# Altium schematic sheet X1.SchDoc
size A4; SheetNumber: 1; SheetTotal: 1; SPICEModelCacheZMLIXMBS: <root> / <DocumentId>ZMLIXMBS</DocumentId> / <CacheFrame Number="0"> / <Model Name="cap" Kind="MDL"> / <Text>*Default semiconductor capacitor / .MODEL CAP C()</Text> / </Model> / <Model Name="xtal" Kind="CKT"> / <Text>*Generic type:crystal pkg:HC33/51 / .SUBCKT XTAL 1 2 PARAMS: FREQ=1Meg RS=750 C=13pf Q=1000 / LX 1 3 {((Q*RS)/(6.2831852*FREQ))} IC=0.5M / CX 3 4 {(1/(Q*6.2831852*FREQ*RS))} / C0 1 2 {C} / RS 4 2 {RS} / .ENDS XTAL</Text> / </Model> / <Model Name="led2" Kind="MDL"> / <Text>*Typ RED,GREEN,YELLOW,AMBER GaAs LED: Vf=2.1V Vr=4V If=40mA trr=3uS / *LED Pinout: 1=A, 2=K / .MODEL LED2 D (IS=93.1P RS=42M N=4.61 BV=4 IBV=10U / + CJO=2.97P VJ=.75 M=.333 TT=4.32U)</Text> / </Model> / <Model Name="1n4148" Kind="MDL"> / <Text>.model 1N4148  D(Is=0.1p Rs=16 CJO=2p Tt=12n Bv=100 Ibv=0.1p)</Text> / </Model> / </CacheFrame> / </root>
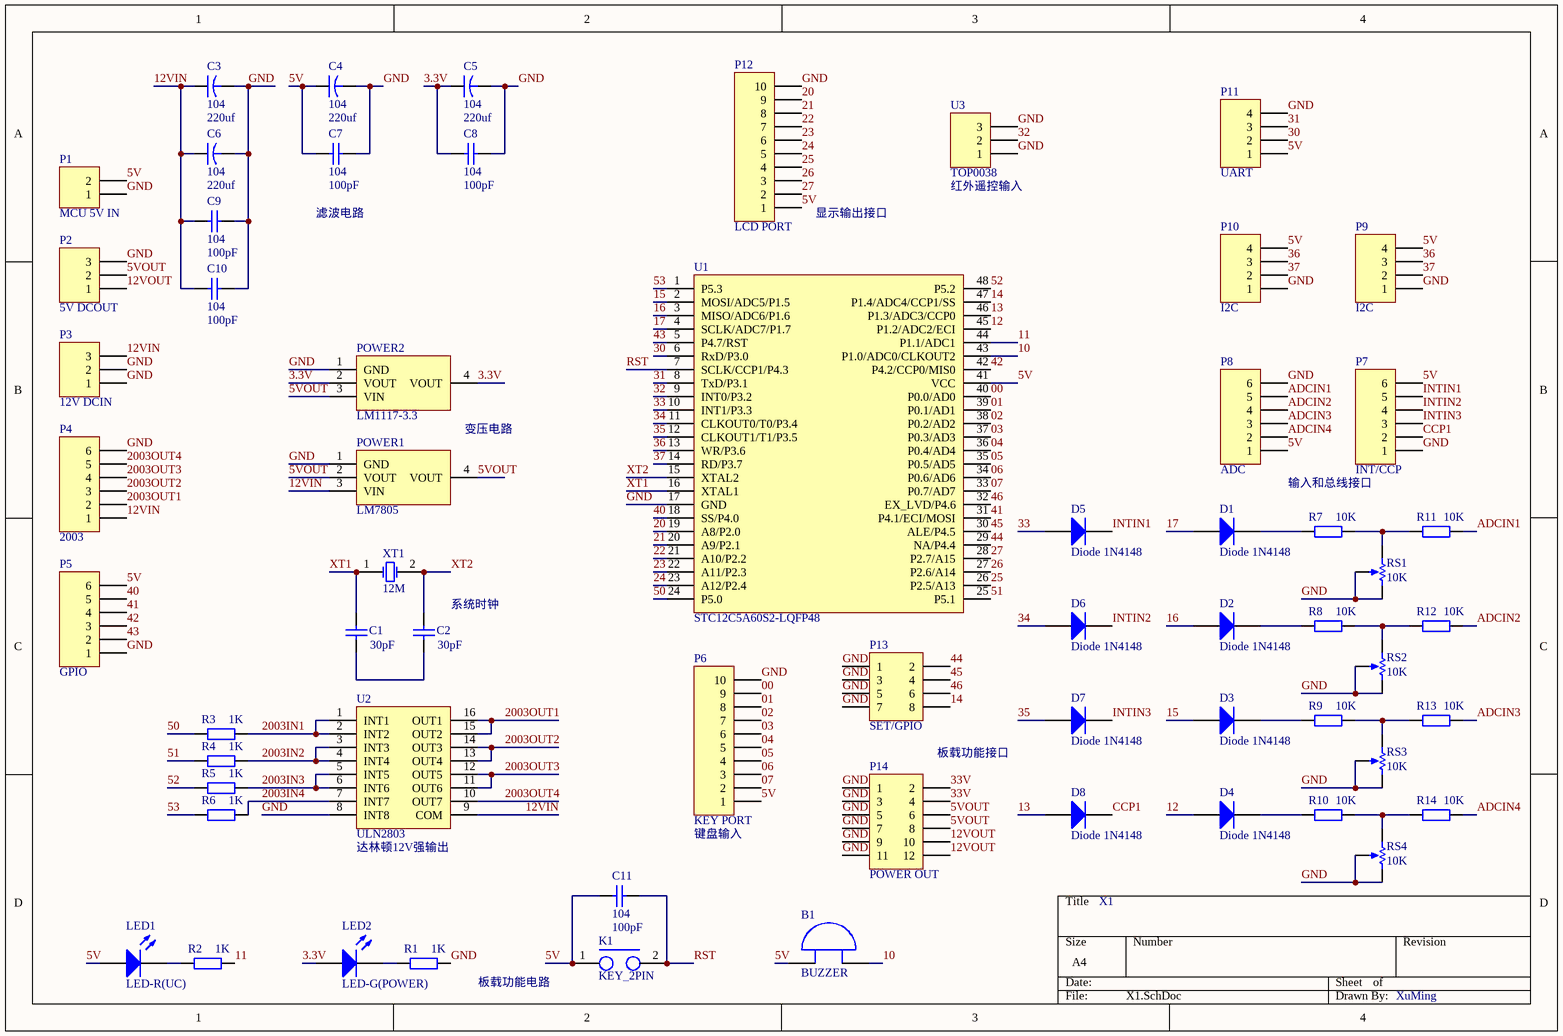
[diagram p0: X1.SchDoc]

## Parts
B1  BUZZER  [BEEP1]
C1  value 30pF  [0805]  (hidden comment: Cap)
C2  value 30pF  [0805]  (hidden comment: Cap)
C3  104  value 220uf  [C107V]
C4  104  value 220uf  [C107V]
C5  104  value 220uf  [C107V]
C6  104  value 220uf  [C107V]
C7  104  value 100pF  [0805]
C8  104  value 100pF  [0805]
C9  104  value 100pF  [0805]
C10  104  value 100pF  [0805]
C11  104  value 100pF  [0805]
D1  Diode 1N4148  [0805]
D2  Diode 1N4148  [0805]
D3  Diode 1N4148  [0805]
D4  Diode 1N4148  [0805]
D5  Diode 1N4148  [0805]
D6  Diode 1N4148  [0805]
D7  Diode 1N4148  [0805]
D8  Diode 1N4148  [0805]
K1  KEY_2PIN  [KEY-4Pin]
LED1  LED-R(UC)  [0805]
LED2  LED-G(POWER)  [0805]
P1  MCU 5V IN  [HDR1X2]
P2  5V DCOUT  [HDR1X3]
P3  12V DCIN  [HDR1X3]
P4  2003  [HDR1X6]
P5  GPIO  [HDR1X6]
P6  KEY PORT  [HDR1X10]
P7  INT/CCP  [HDR1X6]
P8  ADC  [HDR1X6]
P9  I2C  [HDR1X4]
P10  I2C  [HDR1X4]
P11  UART  [HDR1X4]
P12  LCD PORT  [HDR1X10]
P13  SET/GPIO  [HDR2X4]
P14  POWER OUT  [HDR2X6]
POWER1  LM7805  [SOT223_N]
POWER2  LM1117-3.3  [SOT223_N]
R1  value 1K  [0805]  (hidden comment: Res2)
R2  value 1K  [0805]  (hidden comment: Res2)
R3  value 1K  [0805]  (hidden comment: Res2)
R4  value 1K  [0805]  (hidden comment: Res2)
R5  value 1K  [0805]  (hidden comment: Res2)
R6  value 1K  [0805]  (hidden comment: Res2)
R7  value 10K  [0805]  (hidden comment: Res2)
R8  value 10K  [0805]  (hidden comment: Res2)
R9  value 10K  [0805]  (hidden comment: Res2)
R10  value 10K  [0805]  (hidden comment: Res2)
R11  value 10K  [0805]  (hidden comment: Res2)
R12  value 10K  [0805]  (hidden comment: Res2)
R13  value 10K  [0805]  (hidden comment: Res2)
R14  value 10K  [0805]  (hidden comment: Res2)
RS1  value 10K  [VR5]  (hidden comment: RPot)
RS2  value 10K  [VR5]  (hidden comment: RPot)
RS3  value 10K  [VR5]  (hidden comment: RPot)
RS4  value 10K  [VR5]  (hidden comment: RPot)
U1  STC12C5A60S2-LQFP48  [LQFP-48_7x7x05P]
U2  ULN2803  [SOP-16]
U3  TOP0038  [HDR1X3]
XT1  12M  [R38]

## Nets
00: P6.9 U1.40(P0.0/AD0)
01: P6.8 U1.39(P0.1/AD1)
02: P6.7 U1.38(P0.2/AD2)
03: P6.6 U1.37(P0.3/AD3)
3.3V: C5.1 C8.1 LED2.1(A) POWER2.2(VOUT) POWER2.4(VOUT)
04: P6.5 U1.36(P0.4/AD4)
05: P6.4 U1.35(P0.5/AD5)
5V: B1.1 C4.1 C7.1 C11.1 K1.1 LED1.1(A) P1.2 P5.6 P6.1 P7.6 P8.1 P9.4 P10.4 P11.1 P12.1 U1.41(VCC)
5VOUT: P2.2 P14.6 P14.8 POWER1.2(VOUT) POWER1.4(VOUT) POWER2.3(VIN)
06: P6.3 U1.34(P0.6/AD6)
07: P6.2 U1.33(P0.7/AD7)
10: B1.2 U1.43(P1.0/ADC0/CLKOUT2)
11: R2.2 U1.44(P1.1/ADC1)
12: D4.1(A) U1.45(P1.2/ADC2/ECI)
12VIN: C3.1 C6.1 C9.1 C10.1 P3.3 P4.1 POWER1.3(VIN) U2.9(COM)
12VOUT: P2.1 P14.10 P14.12
13: D8.1(A) U1.46(P1.3/ADC3/CCP0)
14: P13.8 U1.47(P1.4/ADC4/CCP1/SS)
15: D3.1(A) U1.2(MOSI/ADC5/P1.5)
16: D2.1(A) U1.3(MISO/ADC6/P1.6)
17: D1.1(A) U1.4(SCLK/ADC7/P1.7)
20: P12.9 U1.19(A8/P2.0)
21: P12.8 U1.20(A9/P2.1)
22: P12.7 U1.21(A10/P2.2)
23: P12.6 U1.22(A11/P2.3)
24: P12.5 U1.23(A12/P2.4)
25: P12.4 U1.26(P2.5/A13)
26: P12.3 U1.27(P2.6/A14)
27: P12.2 U1.28(P2.7/A15)
30: P11.2 U1.6(RxD/P3.0)
31: P11.3 U1.8(TxD/P3.1)
32: U1.9(INT0/P3.2) U3.2
33: D5.1(A) U1.10(INT1/P3.3)
33V: P14.2 P14.4
34: D6.1(A) U1.11(CLKOUT0/T0/P3.4)
35: D7.1(A) U1.12(CLKOUT1/T1/P3.5)
36: P9.3 P10.3 U1.13(WR/P3.6)
37: P9.2 P10.2 U1.14(RD/P3.7)
40: P5.5 U1.18(SS/P4.0)
41: P5.4 U1.31(P4.1/ECI/MOSI)
42: P5.3 U1.42(P4.2/CCP0/MIS0)
43: P5.2 U1.5(P4.7/RST)
44: P13.2 U1.29(NA/P4.4)
45: P13.4 U1.30(ALE/P4.5)
46: P13.6 U1.32(EX_LVD/P4.6)
50: R3.1 U1.24(P5.0)
51: R4.1 U1.25(P5.1)
52: R5.1 U1.48(P5.2)
53: R6.1 U1.1(P5.3)
2003IN1: R3.2 U2.1(INT1) U2.2(INT2)
2003IN2: R4.2 U2.3(INT3) U2.4(INT4)
2003IN3: R5.2 U2.5(INT5) U2.6(INT6)
2003IN4: R6.2 U2.7(INT7)
2003OUT1: P4.2 U2.15(OUT2) U2.16(OUT1)
2003OUT2: P4.3 U2.13(OUT4) U2.14(OUT3)
2003OUT3: P4.4 U2.11(OUT6) U2.12(OUT5)
2003OUT4: P4.5 U2.10(OUT7)
ADCIN1: P8.5 R11.2
ADCIN2: P8.4 R12.2
ADCIN3: P8.3 R13.2
ADCIN4: P8.2 R14.2
CCP1: D8.2(K) P7.2
GND: C3.2 C4.2 C5.2 C6.2 C7.2 C8.2 C9.2 C10.2 P1.1 P2.3 P3.1 P3.2 P4.6 P5.1 P6.10 P7.1 P8.6 P9.1 P10.1 P11.4 P12.10 P13.1 P13.3 P13.5 P13.7 P14.1 P14.3 P14.5 P14.7 P14.9 P14.11 POWER1.1(GND) POWER2.1(GND) R1.2 RS1.2(BOT) RS1.3(TAP) RS2.2(BOT) RS2.3(TAP) RS3.2(BOT) RS3.3(TAP) RS4.2(BOT) RS4.3(TAP) U1.17(GND) U2.8(INT8) U3.1 U3.3
INTIN1: D5.2(K) P7.5
INTIN2: D6.2(K) P7.4
INTIN3: D7.2(K) P7.3
RST: C11.2 K1.2 U1.7(SCLK/CCP1/P4.3)
XT1: C1.2 U1.16(XTAL1) XT1.1(OSC1)
XT2: C2.2 U1.15(XTAL2) XT1.2(OSC2)
NetC1_1: C1.1 C2.1
NetD1_2: D1.2(K) R7.1
NetD2_2: D2.2(K) R8.1
NetD3_2: D3.2(K) R9.1
NetD4_2: D4.2(K) R10.1
NetLED1_2: LED1.2(K) R2.1
NetLED2_2: LED2.2(K) R1.1
NetR7_2: R7.2 R11.1 RS1.1(TOP)
NetR8_2: R8.2 R12.1 RS2.1(TOP)
NetR9_2: R9.2 R13.1 RS3.1(TOP)
NetR10_2: R10.2 R14.1 RS4.1(TOP)

## Notes on the sheet
- 滤波电路
- (near P12) 显示输出接口
- (near U3) 红外遥控输入
- 变压电路
- 输入和总线接口
- (near C2) 系统时钟
- 板载功能接口
- (near U2) 达林顿12V强输出
- (near P6) 键盘输入
- X1
- (near R1) 板载功能电路
- XuMing

## Library data of the parts
C1 C2 C7-C11 = Cap: Capacitor; Published: 8-Jun-2000; LatestRevisionDate: 17-Jul-2002; LatestRevisionNote: Re-released for DXP Platform.; PackageReference: RAD-0.3; Publisher: Altium Limited; PackageDescription: Radial Cap, Thru-Hole; 2 Leads; 0.3 in Pin Spacing
C3-C6 = Cap2: Capacitor; Published: 23-Sep-2002; PackageReference: CAPR5-4X5; Publisher: Altium Limited; PackageDescription: Capacitor; 2 Leads
D1-D8 = Diode 1N4148: High Conductance Fast Diode; Published: 8-Jun-2000; LatestRevisionDate: 17-Jul-2002; LatestRevisionNote: Re-released for DXP Platform.; DatasheetVersion: 1997; PackageReference: DO-35; Publisher: Altium Limited; PackageDescription: Diode, Axial; Body 3.8 x 1.9 mm (LxDia. max), Lead Dia. 0.53 mm (max); Code_JEDEC: DO-204-AH; ComponentLink1Description: Manufacturer Link; ComponentLink1URL: http://www.fairchildsemi.com/; ComponentLink2Description: Datasheet; ComponentLink2URL: http://www.fairchildsemi.com/ds/1N%2F1N4148.pdf
LED1 LED2 = LED2: Typical RED, GREEN, YELLOW, AMBER GaAs LED; Published: 8-Jun-2000; LatestRevisionDate: 17-Jul-2002; LatestRevisionNote: Re-released for DXP Platform.; PackageVersion: Feb-2002; PackageReference: 3.2X1.6X1.1; Publisher: Altium Limited; PackageDescription: SM LED; 2 Flat Leads
P1 = Header 2: Header, 2-Pin; LatestRevisionDate: 17-Jul-2002; LatestRevisionNote: Re-released for DXP Platform.; Publisher: Altium Limited
P2 P3 U3 = Header 3: Header, 3-Pin; LatestRevisionDate: 17-Jul-2002; LatestRevisionNote: Re-released for DXP Platform.; Publisher: Altium Limited
P4 P5 P7 P8 = Header 6: Header, 6-Pin; LatestRevisionDate: 17-Jul-2002; LatestRevisionNote: Re-released for DXP Platform.; Publisher: Altium Limited
P6 P12 = Header 10: Header, 10-Pin; LatestRevisionDate: 17-Jul-2002; LatestRevisionNote: Re-released for DXP Platform.; Publisher: Altium Limited
P9-P11 = Header 4: Header, 4-Pin; LatestRevisionDate: 17-Jul-2002; LatestRevisionNote: Re-released for DXP Platform.; Publisher: Altium Limited
P13 = Header 4X2: Header, 4-Pin, Dual row; LatestRevisionDate: 17-Jul-2002; LatestRevisionNote: Re-released for DXP Platform.; Publisher: Altium Limited
P14 = Header 6X2: Header, 6-Pin, Dual row; LatestRevisionDate: 17-Jul-2002; LatestRevisionNote: Re-released for DXP Platform.; Publisher: Altium Limited
POWER2 = LM7805
R1-R14 = Res2: Resistor; Published: 8-Jun-2000; LatestRevisionDate: 17-Jul-2002; LatestRevisionNote: Re-released for DXP Platform.; PackageReference: AXIAL-0.4; Publisher: Altium Limited; PackageDescription: Axial Device, Thru-Hole; 2 Leads; 0.4 in Pin Spacing
RS1-RS4 = RPot: Potentiometer; Sim Note: Enter the Resistance value and the set point into parameter fields.; Set Position: 0.5; Published: 8-Jun-2000; LatestRevisionDate: 17-Jul-2002; LatestRevisionNote: Re-released for DXP Platform.; PackageReference: VR5; Publisher: Altium Limited; PackageDescription: Variable Resistor, Thru-Hole; 3 Leads
U2 = ULN2003
XT1 = XTAL: Crystal Oscillator; Published: 8-Jun-2000; LatestRevisionDate: 17-Jul-2002; LatestRevisionNote: Re-released for DXP Platform.; PackageReference: R38; Publisher: Altium Limited; PackageDescription: Crystal, Thru-Hole; 2 Leads; Body 3.1 x 8.2 mm (Dia.xH)